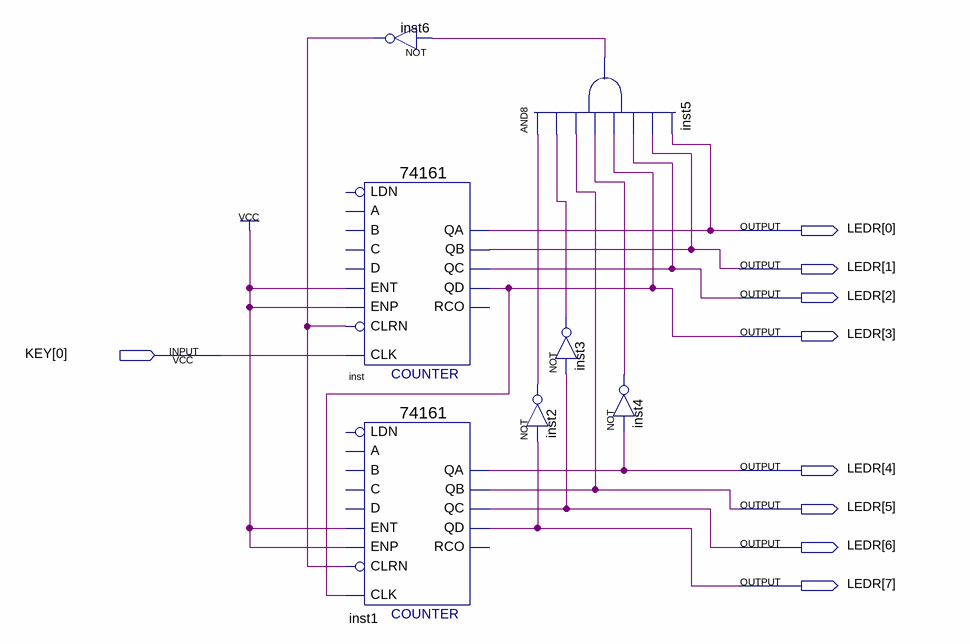
[diagram p0: schematic sheet]
// Quartus schematic lab32.bdf as structural Verilog: 7 symbols, 9 pins
module lab32 (
  input  [0:0] KEY,
  output [7:0] LEDR
);

  wire inst2_out, inst3_out, inst4_out, inst5_out, inst6_out;

  not inst6 (inst6_out, inst5_out);
  \74161  inst (
    .CLRN(inst6_out), .CLK(KEY[0]), .ENP(1'b1), .ENT(1'b1), .QD(LEDR[3]), .QC(LEDR[2]), .QB(LEDR[1]),
    .QA(LEDR[0]));  // open: LDN, A, D, B, C, RCO
  \74161  inst1 (
    .CLRN(inst6_out), .CLK(LEDR[3]), .ENP(1'b1), .ENT(1'b1), .QD(LEDR[7]), .QC(LEDR[6]), .QB(LEDR[5]),
    .QA(LEDR[4]));  // open: LDN, A, D, B, C, RCO
  and inst5 (inst5_out, inst2_out, inst3_out, LEDR[5], inst4_out, LEDR[3], LEDR[2], LEDR[1], LEDR[0]);
  not inst2 (inst2_out, LEDR[7]);
  not inst3 (inst3_out, LEDR[6]);
  not inst4 (inst4_out, LEDR[4]);
endmodule
